# Altium schematic sheet com_port.SchDoc: COM Port
size A4; Organization: Zigman Nikita; Address3: zigman.nikita@gmail.com; DocumentNumber: 1.0; Revision: ZN; SheetNumber: 4; SheetTotal: 6
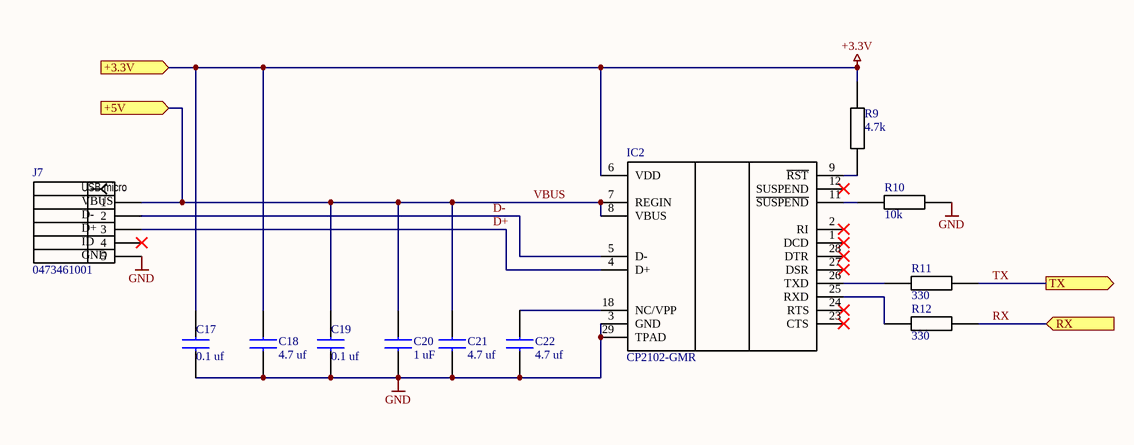
[diagram p0: com_port.SchDoc]

## Parts
C17  0.1 uf  [CAPC1608X90N]
C18  4.7 uf  [CAPC1608X90N]
C19  0.1 uf  [CAPC1608X90N]
C20  1 uF  [CAPC1608X90N]
C21  4.7 uf  [CAPC1608X90N]
C22  4.7 uf  [CAPC1608X90N]
IC2  CP2102-GMR  [QFN50P500X500X100-29N-D]
J7  0473461001  [0473461001]
R9  4.7k  [RESC1608X55N]
R10  10k  [RESC1608X55N]
R11  330  [RESC1608X55N]
R12  330  [RESC1608X55N]

## Ports
+3.3V (in), +5V (in), RX (in), TX (out)

## Nets
+3.3V: C17.2 C18.2 IC2.6(VDD) R9.2 ; port +3.3V
GND: C17.1 C18.1 C19.1 C20.1 C21.1 C22.1 IC2.3(GND) IC2.29(TPAD) J7.5 R10.1
D+: IC2.4(D+) J7.3
D-: IC2.5(D-) J7.2
RX: R12.1 ; port RX
TX: R11.1 ; port TX
VBUS: C19.2 C20.2 C21.2 IC2.7(REGIN) IC2.8(VBUS) J7.1 ; port +5V
NetC22_2: C22.2 IC2.18(NC/VPP)
NetIC2_9: IC2.9(~{RST}) R9.1
NetIC2_11: IC2.11(~{SUSPEND}) R10.2
NetIC2_25: IC2.25(RXD) R12.2
NetIC2_26: IC2.26(TXD) R11.2

Not connected (* = marked no-connect by the designer): IC2 1(DCD)* 2(RI)* 12(SUSPEND)* 23(CTS)* 24(RTS)* 27(DSR)* 28(DTR)*; J7 4*

## Notes on the sheet
- Title
- Size:
- Date:
- A4
- Number:
- Time:
- Revision:
- Sheet
- of
- File:
- (in symbol 0473461001) USB micro; VBUS; D-; D+; ID; GND

## Library data of the parts
C17 C19 = 0603: AVX 0.1 uF 16v dc 0603; Datasheet Link: https://at.rs-online.com/web/p/keramik-vielschichtkondensatoren/1358340/; Height: 0.9mm; Manufacturer_Name: AVX
C18 C21 C22 = 0603: AVX, SMD MLCC 4.7 uF 10 V dc, 0603; Datasheet Link: https://at.rs-online.com/web/p/keramik-vielschichtkondensatoren/1353676/; Height: 0.9mm; Manufacturer_Name: AVX
C20 = 0603: AVX SMD 1uF 16V 0603; Datasheet Link: https://at.rs-online.com/web/p/keramik-vielschichtkondensatoren/8882257/; Height: 0.9mm; Manufacturer_Name: AVX
IC2 = CP2102-GMR: Integrated Circuit; Manufacturer_Name: Silicon Labs; Datasheet Link: https://at.rs-online.com/web/p/multiprotokoll-transceiver/5268841/; Height: 1mm; Manufacturer_Part_Number: CP2102-GMR; Arrow Part Number: CP2102-GMR; Arrow Price/Stock: https://www.arrow.com/en/products/cp2102-gmr/silicon-labs; Mouser Part Number: 634-CP2102-GMR; Mouser Price/Stock: https://www.mouser.co.uk/ProductDetail/Silicon-Labs/CP2102-GMR?qs=cNyzPCcHMUWu%2FiPhR8KQAw%3D%3D
J7 = 0473461001: Connector; Manufacturer_Name: Molex; Datasheet Link: https://componentsearchengine.com/Datasheets/1/0473461001.pdf; Height: 2.45mm; Manufacturer_Part_Number: 0473461001; Arrow Part Number: 0473461001; Arrow Price/Stock: https://www.arrow.com/en/products/0473461001/molex; Mouser Part Number: N/A; Mouser Price/Stock: https://www.mouser.com/Search/Refine.aspx?Keyword=N%2FA
R9 = res 0603: 4.7k 0603; Manufacturer_Name: TE Connectivity; Manufacturer_Part_Number: CPF0603B100RE1; Datasheet Link: http://www.farnell.com/datasheets/1786775.pdf; Height: 0.55mm; Arrow Part Number: CPF0603B100RE1; Arrow Price/Stock: https://www.arrow.com/en/products/cpf0603b100re1/te-connectivity; Mouser Part Number: 279-CPF0603B100RE1; Mouser Price/Stock: https://www.mouser.co.uk/ProductDetail/TE-Connectivity-Neohm/CPF0603B100RE1?qs=DfH2yQaBz6s2KWheq2AlNw%3D%3D
R10 = res 0603: 10k 0603; Manufacturer_Name: TE Connectivity; Manufacturer_Part_Number: CPF0603B100RE1; Datasheet Link: http://www.farnell.com/datasheets/1786775.pdf; Height: 0.55mm; Arrow Part Number: CPF0603B100RE1; Arrow Price/Stock: https://www.arrow.com/en/products/cpf0603b100re1/te-connectivity; Mouser Part Number: 279-CPF0603B100RE1; Mouser Price/Stock: https://www.mouser.co.uk/ProductDetail/TE-Connectivity-Neohm/CPF0603B100RE1?qs=DfH2yQaBz6s2KWheq2AlNw%3D%3D
R11 R12 = res 0603: 330 0603; Manufacturer_Name: TE Connectivity; Manufacturer_Part_Number: CPF0603B100RE1; Datasheet Link: http://www.farnell.com/datasheets/1786775.pdf; Height: 0.55mm; Arrow Part Number: CPF0603B100RE1; Arrow Price/Stock: https://www.arrow.com/en/products/cpf0603b100re1/te-connectivity; Mouser Part Number: 279-CPF0603B100RE1; Mouser Price/Stock: https://www.mouser.co.uk/ProductDetail/TE-Connectivity-Neohm/CPF0603B100RE1?qs=DfH2yQaBz6s2KWheq2AlNw%3D%3D